# Altium schematic sheet indicator.SchDoc
size A; SheetNumber: 1; SheetTotal: 1; SPICEModelCacheEUOJZBIQ: <root> / <DocumentId>EUOJZBIQ</DocumentId> / </root>
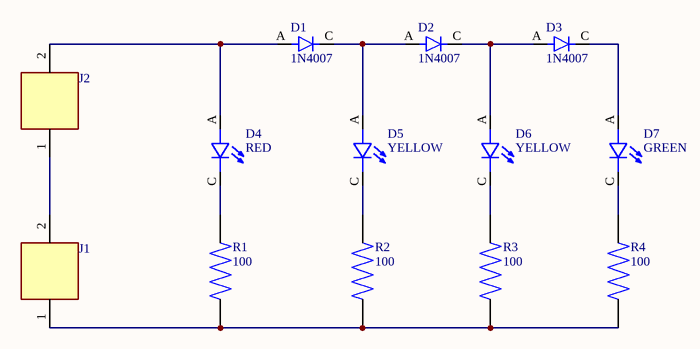
[diagram p0: indicator.SchDoc]

## Parts
D1  1N4007  [DIOAD1060W80L520D270]
D2  1N4007  [DIOAD1060W80L520D270]
D3  1N4007  [DIOAD1060W80L520D270]
D4  RED  [LEDRD254W57D500H1070]
D5  YELLOW  [LEDRD254W57D500H1070]
D6  YELLOW  [LEDRD254W57D500H1070]
D7  GREEN  [LEDRD254W57D500H1070]
J1  64900221122  [64900221122]  (value not drawn)
J2  64900221122  [64900221122]  (value not drawn)
R1  100  [RESAD1100W55L680D260]
R2  100  [RESAD1100W55L680D260]
R3  100  [RESAD1100W55L680D260]
R4  100  [RESAD1100W55L680D260]

## Nets
NetD1_A: D1.A D4.A J2.2
NetD1_C: D1.C D2.A D5.A
NetD2_C: D2.C D3.A D6.A
NetD3_C: D3.C D7.A
NetD4_C: D4.C R1.2
NetD5_C: D5.C R2.2
NetD6_C: D6.C R3.1
NetD7_C: D7.C R4.1
NetJ1_1: J1.1 R1.1 R2.1 R3.2 R4.2
NetJ1_2: J1.2 J2.1

## Library data of the parts
D1-D3 = 1N4007: Diode Switching 1KV 1A 2-Pin DO-41; Price: None; MP: 1N4007; Value: *; Availability: Unavailable; Package: None
D4-D7 = L08R5000Q1: LED, Orange, Through Hole, T-1 3/4 (5mm), 30 mA, 2.1 V, 635 nm; Price: None; MP: L08R5000Q1; Value: *; Availability: Unavailable; Package: None
J1 J2 = 64900221122: Connector Header Through Hole 2 position; MF: Wurth Electronics; Package: None; Availability: Unavailable; MP: 64900221122; Value: *; SnapEDA_Link: https://www.snapeda.com/parts/64900221122/Wurth%20Electronics%20Inc./view-part/1276779/?ref=snap; Price: None
R1-R3 = MFR-25FBF52-1K: Through Hole Resistor Axial - Metal Film; MF: Yageo; Package: Axial Yageo; Check_prices: https://www.snapeda.com/parts/MFR-25FBF52-1K/Yageo/view-part/?ref=eda; Availability: In Stock; MP: MFR-25FBF52-1K; Value: *; Purchase-URL: https://pricing.snapeda.com/search/part/MFR-25FBF52-1K/?ref=eda; Price: None; SnapEDA_Link: https://www.snapeda.com/parts/MFR-25FBF52-1K/Yageo/view-part/?ref=snap
R4 = MFR-25FBF52-1K: 1.78 kOhms Â±1% 0.25W, 1/4W Through Hole Resistor Axial - Metal Film; MF: Yageo; Package: Axial Yageo; Check_prices: https://www.snapeda.com/parts/MFR-25FBF52-1K/Yageo/view-part/?ref=eda; Availability: In Stock; MP: MFR-25FBF52-1K; Value: *; Purchase-URL: https://pricing.snapeda.com/search/part/MFR-25FBF52-1K/?ref=eda; Price: None; SnapEDA_Link: https://www.snapeda.com/parts/MFR-25FBF52-1K/Yageo/view-part/?ref=snap